# Altium schematic sheet 02-POWER SUPPLY.SchDoc
size A4
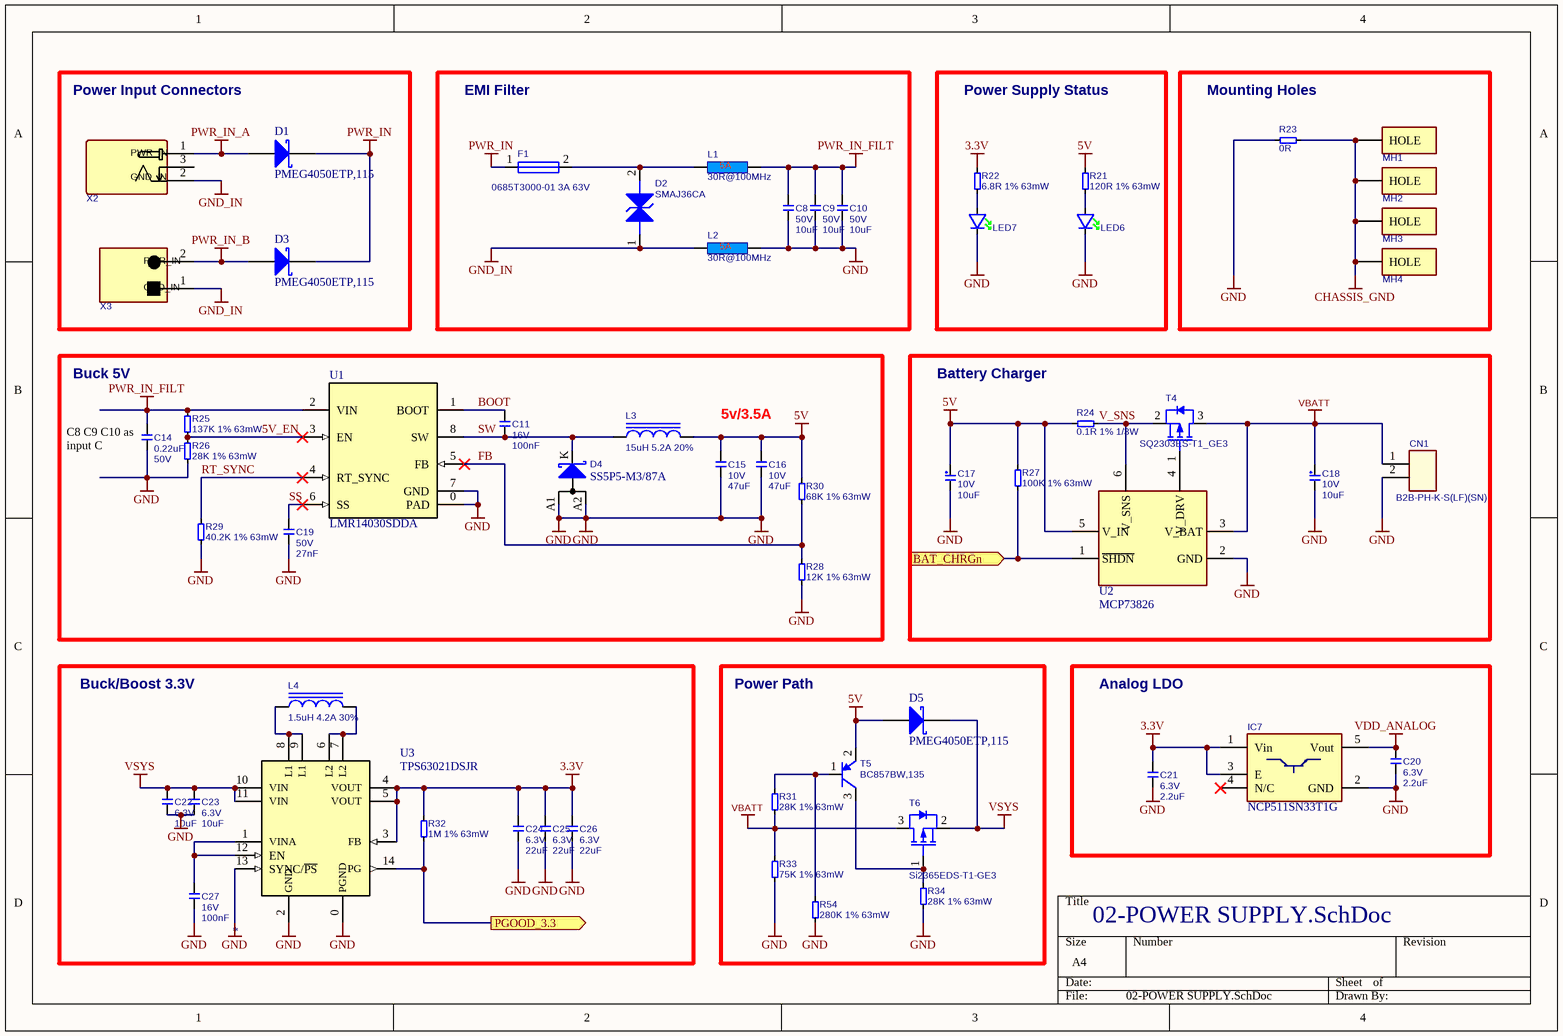
[diagram p0: 02-POWER SUPPLY.SchDoc]

## Parts
C8  value 10uF  Rating: 50V  [CAPC3225X160N]  (hidden comment: 10uF 50V 20% X5R)
C9  value 10uF  Rating: 50V  [CAPC3225X160N]  (hidden comment: 10uF 50V 20% X5R)
C10  value 10uF  Rating: 50V  [CAPC3225X160N]  (hidden comment: 10uF 50V 20% X5R)
C11  value 100nF  Rating: 16V  [CAPC1005X60N]  (hidden comment: 100nF 16V 10% X7R)
C14  value 0.22uF  Rating: 50V  [T_CAPC0805X125N]  (hidden comment: 0.22uF 50V 10% X7R)
C15  value 47uF  Rating: 10V  [CAPC3225X160N]  (hidden comment: 47uF 10V 20% X5R)
C16  value 47uF  Rating: 10V  [CAPC3225X160N]  (hidden comment: 47uF 10V 20% X5R)
C17  value 10uF  Rating: 10V  [T_CAPC1206X180N]  (hidden comment: 10uF 10V 20% Tantalum)
C18  value 10uF  Rating: 10V  [T_CAPC1206X180N]  (hidden comment: 10uF 10V 20% Tantalum)
C19  value 27nF  Rating: 50V  [T_CAPC0603X33N]  (hidden comment: 27nF 50V 20% X7R)
C20  value 2.2uF  Rating: 6.3V  [T_CAPC0603X33N]  (hidden comment: 2.2uF 6.3V 20% X5R)
C21  value 2.2uF  Rating: 6.3V  [T_CAPC0603X33N]  (hidden comment: 2.2uF 6.3V 20% X5R)
C22  value 10uF  Rating: 6.3V  [T_CAPC0603X33N]  (hidden comment: 10uF 6.3V 20% X5R)
C23  value 10uF  Rating: 6.3V  [T_CAPC0603X33N]  (hidden comment: 10uF 6.3V 20% X5R)
C24  value 22uF  Rating: 6.3V  [T_CAPC0603X33N]  (hidden comment: 22uF 6.3V 20% X5R)
C25  value 22uF  Rating: 6.3V  [T_CAPC0603X33N]  (hidden comment: 22uF 6.3V 20% X5R)
C26  value 22uF  Rating: 6.3V  [T_CAPC0603X33N]  (hidden comment: 22uF 6.3V 20% X5R)
C27  value 100nF  Rating: 16V  [CAPC1005X60N]  (hidden comment: 100nF 16V 10% X7R)
CN1  B2B-PH-K-S(LF)(SN)  [B2B-PH-K-S(LF)(SN) - duplicate]
D1  PMEG4050ETP,115  [D_SOD128]
D2  SMAJ36CA  [T_LITTLEFUSE_SMAJ30CA]
D3  PMEG4050ETP,115  [D_SOD128]
D4  SS5P5-M3/87A  [T_DIOM_TO277A]
D5  PMEG4050ETP,115  [D_SOD128]
F1  0685T3000-01 3A 63V  [RESC3216N]
IC7  NCP511SN33T1G  [SOT95P279X142-5N]
L1  value 30R@100MHz  [INDC1608X95N]  (hidden comment: BLM18KG300TN1D)
L2  value 30R@100MHz  [INDC1608X95N]  (hidden comment: BLM18KG300TN1D)
L3  15uH 5.2A 20%  [T_INDM125125X80N]
L4  1.5uH 4.2A 30%  [L_NR6028]
LED6  150060GS75000  [LEDC1608X80N]  (value not drawn)
LED7  150060GS75000  [LEDC1608X80N]  (value not drawn)
MH1  MECH-MountingHoles  [T_MountingHoles]  (value not drawn)  (no BOM)
MH2  MECH-MountingHoles  [T_MountingHoles]  (value not drawn)  (no BOM)
MH3  MECH-MountingHoles  [T_MountingHoles]  (value not drawn)  (no BOM)
MH4  MECH-MountingHoles  [T_MountingHoles]  (value not drawn)  (no BOM)
R21  120R 1% 63mW  [RESC1005X40N]
R22  6.8R 1% 63mW  [RESC1005X40N]
R23  0R  [RESC1005X40N]
R24  0.1R 1% 1/3W  [RESC1608N]
R25  137K 1% 63mW  [RESC1005X40N]
R26  28K 1% 63mW  [RESC1005X40N]
R27  100K 1% 63mW  [RESC1005X40N]
R28  12K 1% 63mW  [RESC1005X40N]
R29  40.2K 1% 63mW  [RESC1005X40N]
R30  68K 1% 63mW  [RESC1005X40N]
R31  28K 1% 63mW  [RESC1005X40N]
R32  1M 1% 63mW  [RESC1005X40N]
R33  75K 1% 63mW  [RESC1005X40N]
R34  28K 1% 63mW  [RESC1005X40N]
R54  280K 1% 63mW  [RESC1005X40N]
T4  SQ2303ES-T1_GE3  [SOT95P230X110-3N]
T5  BC857BW,135  [SOT65P210X110-3N]
T6  Si2365EDS-T1-GE3  [SOT95P230X110-3N]
U1  LMR14030SDDA  [SOIC127P600X175-9AN-2]
U2  MCP73826  [SOT95P284X122-6N]
U3  TPS63021DSJR  [DSJ14_2P85X1P58]
X2  54-00167  [PJ-002A]  (value not drawn)
X3  1984617  [TERM-BLK-3.5MM]  (value not drawn)

## Blocks framed on the sheet
Power Input Connectors: D1 D3 X2 X3
EMI Filter: C8-C10 D2 F1 L1 L2
Power Supply Status: LED6 LED7 R21 R22
Mounting Holes: MH1-MH4 R23
Battery Charger: C17 C18 CN1 R24 R27 T4 U2
Buck/Boost 3.3V: C22-C27 L4 R32 U3
Power Path: D5 R31 R33 R34 R54 T5 T6
Analog LDO: C20 C21 IC7

## Ports
BAT_CHRGn (in), PGOOD_3.3 (out)

## Nets
3.3V: C21.2 C24.2 C25.2 C26.2 IC7.1(Vin) IC7.3(E) R22.2 R32.2 U3.3(FB) U3.4(VOUT) U3.5(VOUT)
5V: C15.2 C16.2 C17.2 D5.2(A) L3.2 R21.2 R24.2 R27.2 R30.2 T5.2(E) U2.5(V_IN)
CHASSIS_GND: MH1.1(HOLE) MH2.1(HOLE) MH3.1(HOLE) MH4.1(HOLE) R23.1
GND: C8.1 C9.1 C10.1 C14.1 C15.1 C16.1 C17.1 C18.1 C19.1 C20.1 C21.1 C22.1 C23.1 C24.1 C25.1 C26.1 C27.1 CN1.2 D4.A1 D4.A2 IC7.2(GND) L2.1 LED6.1 LED7.1 R23.2 R26.1 R28.2 R29.1 R33.1 R34.1 R54.1 U1.0(PAD) U1.7(GND) U2.2(GND) U3.0(PGND) U3.2(GND) U3.13(SYNC/~{PS})
GND_IN: D2.1(ANODE) L2.2 X2.2(PWR_IN) X3.1(GND_IN)
PWR_IN: D1.1(K) D3.1(K) F1.1
PWR_IN_A: D1.2(A) X2.1(GND_IN)
PWR_IN_B: D3.2(A) X3.2(PWR_IN)
PWR_IN_FILT: C8.2 C9.2 C10.2 C14.2 L1.1 R25.2 U1.2(VIN)
VBATT: C18.2 CN1.1 R31.1 R33.2 T4.3(S) T6.3(S) U2.3(V_BAT)
VDD_ANALOG: C20.2 IC7.5(Vout)
VSYS: C22.2 C23.2 D5.1(K) T6.2(D) U3.10(VIN) U3.11(VIN)
5V_EN: R25.1 R26.2 U1.3(EN)
BAT_CHRGn: R27.1 U2.1(~{SHDN}) ; port BAT_CHRGn
BOOT: C11.1 U1.1(BOOT)
FB: R28.1 R30.1 U1.5(FB)
PGOOD_3.3: R32.1 U3.14(PG) ; port PGOOD_3.3
RT_SYNC: R29.2 U1.4(RT_SYNC)
SS: C19.2 U1.6(SS)
SW: C11.2 D4.K L3.1 U1.8(SW)
V_SNS: R24.1 T4.2(D) U2.6(V_SNS)
NetC27_2: C27.2 U3.1(VINA) U3.12(EN)
NetD2_2: D2.2(CATHODE) F1.2 L1.2
NetL4_1: L4.1 U3.8(L1) U3.9(L1)
NetL4_2: L4.2 U3.6(L2) U3.7(L2)
NetLED6_2: LED6.2 R21.1
NetLED7_2: LED7.2 R22.1
NetR31_2: R31.2 R54.2 T5.1(B)
NetR34_2: R34.2 T5.3(C) T6.1(G)
NetT4_1: T4.1(G) U2.4(V_DRV)

Not connected (* = marked no-connect by the designer): IC7 4(N/C)*; X2 3(PWR_IN)

## Notes on the sheet
- Buck 5V
- 5v/3.5A
- (near C14) C8 C9 C10 as input C
- (in symbol L-Murata-30R@100MHz-5A-0603) 5A

## Library data of the parts
C8-C10 = C-10uF-50V-20%-1210: Capacitor Ceramic X5R 10uF 50V 20% 1210; Type: X7R; FP_DESC: C1210; Tolerance: 20%; Supplier 1: Digi-Key; Supplier Part Number 1: 587-2225-1-ND; Footprint: C1210; MFG: *; MFG_PN: *
C11 C27 = C-100nF-16V-10%-0603: Capacitor Ceramic X7R 100nF 16V 10% 0603; FP_DESC: C0402; Tolerance: 10%; Type: X7R; Supplier 1: Digi-Key; Supplier Part Number 1: 1276-1001-1-ND; Footprint Checked: -; MFG: *; MFG_PN: *
C14 = C-0.22uF-50V-10%-0805: Capacitor Ceramic X7R 0.22uF 50V 10% 0805; FP_DESC: C0805; Tolerance: 10%; Type: X7R; Supplier 1: Digi-Key; Supplier Part Number 1: 1276-1093-1-ND; MFG_PN: *; MFG: *
C15 C16 = C-47uF-10V-20%-1210: Capacitor Ceramic X5R 47uF 10V 20% 1210; FP_DESC: C1210; Tolerance: 20%; Type: X5R; Supplier 1: Digi-Key; Supplier Part Number 1: 445-6711-1-ND; MFG: *; MFG_PN: *
C17 C18 = C-10uF-10V-20%-1206: Capacitor Tantalum 10uF 10V 20% 1206; FP_DESC: C1206; Tolerance: 20%; Type: Tantalum; Supplier 1: Digi-Key; Supplier Part Number 1: 478-1657-1-ND; MFG: *; MFG_PN: *
C19 = C-27nF-50V-10%-0603: Capacitor Ceramic X7R 27nF 50V 10% 0603; FP_DESC: C0603; Tolerance: 10%; Type: X7R; Supplier 1: Digi-Key; Supplier Part Number 1: 1276-2025-1-ND; MFG: *; MFG_PN: *
C20 C21 = C-2.2uF-6.3V-20%-0603: Capacitor Ceramic X5R 2.2uF 6.3V 20% 0603; FP_DESC: C0603; Tolerance: 20%; Supplier 1: Digi-Key; Supplier Part Number 1: 311-1814-1-ND; Type: X5R; MFG: *; MFG_PN: *
C22 C23 = C-10uF-6.3V-20%-0603: Capacitor Ceramic X5R 10uF 6.3V 20% 0603; Type: X7R; FP_DESC: C0603; Tolerance: 20%; Supplier 1: Digi-Key; Supplier Part Number 1: 490-3896-1-ND; MFG: *; MFG_PN: *
C24-C26 = C-22uF-6.3V-20%-0603: Capacitor Ceramic X5R 22uF 6.3V 20% 0603; FP_DESC: C0603; Tolerance: 20%; Type: X5R; Supplier 1: Digi-Key; Supplier Part Number 1: 445-8028-1-ND; MFG: *; MFG_PN: *
CN1 = CON-JST-B2B-PH-K-S(LF)(SN): Connector Header Through Hole 2 position 0.079" (2.00mm); MFG: JST; FP_DESC: Header, Male pins, 1x2, 2mm, Vertical; Symbol Checked: Ok; MFG_PN: B2B-PH-K-S(LF)(SN); Footprint Checked: Assign OK, Footprint OK; Supplier 1: Digi-Key; Supplier Part Number 1: 455-1704-ND
D1 D3 D5 = D-NXP- PMEG4050ETP,115: Diode Schottky 40V 5A Surface Mount CFP5; MFG: Nexperia USA Inc.; Supplier 1: Digi-Key; Supplier Part Number 1: 1727-1732-1-ND; MFG_PN: PMEG4050ETP,115; Footprint Checked: -; Symbol Checked: -
D2 = D-Vishay-SMAJ36CA: 58.1V Clamp 6.9A Ipp Tvs Diode Surface Mount DO-214AC (SMA); MFG: Vishay; Symbol Checked: Ok; FP_DESC: SMA; MFG_PN: SMAJ36CA; Footprint Checked: Assign OK, Footprint OK; Supplier 1: Digi-Key; Supplier Part Number 1: SMAJ36CALFCT-ND
D4 = D-Vishay-SS5P5-M3/87A: Diode Schottky, SS5P5-M3/87A, 50V(Vrrm), 5A(If); MFG: Vishay; MFG_PN: SS8P6C-M3/86A; Supplier 1: Digi-Key; Supplier Part Number 1: SS5P5-M3/87AGICT-ND; Footprint Checked: -; Symbol Checked: -
F1 = F-BEL-3A-63V: 3A 63V AC 63V DC Fuse Board Mount (Cartridge Style Excluded) Surface Mount 1206 (3216 Metric); FP_DESC: R1206; MFG: BEL; POWER: 250mW; MFG_PN: 0685T3000-01; Footprint Checked: -; VALUE: 3A; Symbol Checked: -; Supplier 1: Digi-Key; Supplier Part Number 1: 507-1896-1-ND
IC7 = IC-ON-NCP511SN33T1G: NCP511SN33T1G LDO Regulator; MFG: ON Semiconductor; Supplier 1: Digi-Key; Supplier Part Number 1: NCP511SN33T1GOSCT-ND; Footprint Checked: -; Symbol Checked: -; MFG_PN: NCP511SN33T1G
L1 L2 = L-Murata-30R@100MHz-5A-0603: 30 Ohms @ 100MHz 1 Power Line Ferrite Bead 0603 (1608 Metric) 5A 10mOhm; Rating: 4A; Tolerance: 25%; MFG: EXC-ML20A390U; Supplier 1: Digi-Key; Supplier Part Number 1: 490-5447-1-ND; Footprint Checked: Ok, Assign Ok; Symbol Checked: -
L3 = L-Bourns-SRR1280-150M: FIXED IND 15UH 5.2A 28.5MOHM SMD; MFG: Bourns Inc.; FP_DESC: Non Standard; Footprint Checked: -; Symbol Checked: -; Value: 15uH; Supplier 1: Digi-Key; Supplier Part Number 1: SRR1280-150MCT-ND; MFG_PN: SRR1280-150M
L4 = L-1.5uH-4.2A-30%: Inductor Ferrite core 1.5uH 4.2A 30%; MFG: TAIYO YUDEN; FP_DESC: L1008; MFG_PN: NRS6028T1R5NMGJ; Footprint Checked: -; Symbol Checked: -; Value: 1.5uH; Supplier 1: Digi-Key; Supplier Part Number 1: 587-2937-1-ND
LED6 LED7 = LED-GREEN-0603: Green 520nm LED Indication - Discrete 3.2V 0603 (1608 Metric); MFG: Würth Elektronik; MFG_PN: 150060GS75000; Color: Green; Supplier 1: Digi-Key; Supplier Part Number 1: 732-4971-1-ND; Footprint Checked: -; Symbol Checked: -
MH1-MH4 = MECH-MountingHoles: PCB Mounting Holes, hole diemeter = 3.2mm, pad diameter = 6.2mm; Footprint Checked: -; Symbol Checked: -
R21 = R-120R-1%-0402: Resistor 120ohm 63mW 1% 0402; MFG: <GENERIC>; Power: 63mW; Tolerance: 1%; Footprint: R0402; Value: 120R; Supplier 1: Digi-Key; Supplier Part Number 1: 541-120LCT-ND; Footprint Checked: -; Symbol Checked: -; MFG_PN: <GENERIC>
R22 = R-6.8R-1%-0402: Resistor 6.8ohm 63mW 1% 0402; Manufacturer: <GENERIC>; Replacement Allowed: Yes; Power: 63mW; Tolerance: 1%; Footprint: R0402; Value: 6.8R; Supplier 1: Digi-Key; Supplier Part Number 1: 541-68.0LCT-ND; Manufacturer Part Number: <GENERIC>
R23 = R-0R-0402: Resistor 0ohm 0402; Tolerance: 1%; MFG: <GENERIC>; Power: ?; Value: 0R; Footprint: R0402; Supplier 1: Digi-Key; Supplier Part Number 1: 541-2952-1-ND; Footprint Checked: -; MFG_PN: <GENERIC>; Symbol Checked: -
R24 = R-0.1-1%-0603: Resistor 0.1ohm 1/3W 1% 0603; Power: 1/3; MFG: <GENERIC>; Tolerance: 1%; Value: 0.1R; Footprint: R0603; Supplier 1: Digi-Key; Supplier Part Number 1: P17478CT-ND; Footprint Checked: -; Symbol Checked: -; MFG_PN: <GENERIC>
R25 = R-137K-1%-0402: Resistor 137Kohm 63mW 1% 0402; Symbol Checked: T; MFG: <GENERIC>; Power: 63mW; Tolerance: 1%; Footprint: R0402; Value: 137k; Supplier 1: Digi-Key; Supplier Part Number 1: 541-137KLCT-ND; Footprint Checked: -; MFG_PN: <GENERIC>
R26 R31 R34 = R-28K-1%-0402: Resistor 28Kohm 63mW 1% 0402; Symbol Checked: T; MFG: <GENERIC>; Power: 63mW; Tolerance: 1%; Footprint: R0402; Value: 28k; Supplier 1: Digi-Key; Supplier Part Number 1: 541-4852-1-ND; Footprint Checked: -; MFG_PN: <GENERIC>
R27 = R-100K-1%-0402: Resistor 100Kohm 63mW 1% 0402; Manufacturer: <GENERIC>; Replacement Allowed: Yes; Power: 63mW; Tolerance: 1%; Value: 100k; Footprint: R0402; Supplier 1: Digi-Key; Supplier Part Number 1: 541-100KLCT-ND; Manufacturer Part Number: <GENERIC>
R28 = R-12K-1%-0402: Resistor 12Kohm 63mW 1% 0402; Symbol Checked: T; MFG: <GENERIC>; Power: 63mW; Tolerance: 1%; Footprint: R0402; Value: 12K; Supplier 1: Digi-Key; Supplier Part Number 1: 541-4063-1-ND; Footprint Checked: -; MFG_PN: <GENERIC>
R29 = R-40.2K-1%-0402: Resistor 40.2Kohm 63mW 1% 0402; Symbol Checked: T; MFG: <GENERIC>; Power: 63mW; Tolerance: 1%; Footprint: R0402; Value: 40.2k; Supplier 1: Digi-Key; Supplier Part Number 1: 541-40.2KLCT-ND; Footprint Checked: -; MFG_PN: <GENERIC>
R30 = R-68K-1%-0402_1: Resistor 68Kohm 63mW 1% 0402; Symbol Checked: T; MFG: <GENERIC>; Power: 63mW; Tolerance: 1%; Footprint: R0402; Value: 68K; Supplier 1: Digi-Key; Supplier Part Number 1: 541-68.0KLCT-ND; Footprint Checked: -; MFG_PN: <GENERIC>
R32 = R-1M-1%-0402: Resistor 1Mohm 63mW 1% 0402; Manufacturer: <GENERIC>; Replacement Allowed: Yes; Power: 63mW; Tolerance: 1%; Footprint: R0402; Value: 1M; Supplier 1: Digi-Key; Supplier Part Number 1: 541-1.00MLCT-ND; Manufacturer Part Number: <GENERIC>
R33 = R-75K-1%-0402: Resistor 75Kohm 63mW 1% 0402; MFG: <GENERIC>; Power: 63mW; Tolerance: 1%; Footprint: R0402; Value: 75k; Supplier 1: Digi-Key; Supplier Part Number 1: 541-75.0KLCT-ND; Footprint Checked: -; Symbol Checked: -; MFG_PN: <GENERIC>
R54 = R-280K-1%-0402: Resistor 280Kohm 63mW 1% 0402; MFG: <GENERIC>; Power: 63mW; Tolerance: 1%; Footprint: R0402; Value: 280k; Supplier 1: Digi-Key; Supplier Part Number 1: 541-280KLCT-ND; Footprint Checked: -; Symbol Checked: -; MFG_PN: <GENERIC>
T4 = T-Vishay-SQ2303ES: P-Channel 30V 2.5A (Tc) 1.9W (Tc) Surface Mount TO-236 (SOT-23); MFG: VISHAY; FP_DESC: SOT23-3; MFG_PN: SQ2303ES-T1_GE3; Footprint Checked: -; Symbol Checked: -; Supplier 1: Digi-Key; Supplier Part Number 1: SQ2303ES-T1_GE3CT-ND
T5 = T-NXP-BC857BW: PNP Transistor NXP BC857BW,135; FP_DESC: SOT323; MFG: NXP; MFG_PN: BC857BW,135; Footprint Checked: -; Symbol Checked: -; Supplier 1: Digi-Key; Supplier Part Number 1: 1727-1882-1-ND
T6 = T-Vishay-Si2365EDS: MOSFET, P channel Vishay Si2365EDS-T1-GE3; FP_DESC: SOT23-3; MFG: VISHAY; MFG_PN: Si2365EDS-T1-GE3; Footprint Checked: -; Symbol Checked: -; Supplier 1: Digi-Key; Supplier Part Number 1: SI2365EDS-T1-GE3CT-ND
U1 = IC-TI-LMR14030: Buck Switching Regulator IC Positive Adjustable 0.8V 1 Output 3.5A 8-PowerSOIC (0.154", 3.90mm Width); Symbol Checked: DMT; MFG: Texas Instruments; Type: DEV; Value: Value; Supplier 1: Digi-Key; Supplier Part Number 1: 296-44321-1-ND; Footprint Checked: -
U2 = IC-Microchip-MCP73826: Charger IC Lithium Ion SOT-23-6; Symbol Checked: D; MFG_PN: MCP73826-4.1VCHTR; Footprint Checked: -; MFG: Microchip; Supplier 1: Digi-Key; Supplier Part Number 1: MCP73826-4.1VCHCT-ND
U3 = IC-TI-TPS63021: Buck-Boost Switching Regulator IC Positive Fixed 3.3V 1 Output 3.5A (Switch) 14-VFDFN Exposed Pad; MFG: Texas Instruments; Type: DEV; Value: Value; Supplier 1: Digi-Key; Supplier Part Number 1: 296-27259-1-ND; Footprint Checked: D; Symbol Checked: -; Parameter 1: *
X2 = CON-Tensility-54-00167: Power Barrel Connector Jack 2.50mm ID (0.098"), 5.50mm OD (0.217") Through Hole, Right Angle; MFG: Tensility International Corp; Supplier 1: Digi-Key; Supplier Part Number 1: 839-54-00167-ND; Footprint Checked: -; MFG_PN: 54-00167; Symbol Checked: -
X3 = CON-Phoenix-1984617-1x2-3.5mm: 2 Position Wire to Board Terminal Block Horizontal with Board 0.138" (3.50mm) Through Hole; No. of ways: 1x2; Pitch: 3.5mm; MFG: Phoenix Contact; Supplier 1: Digi-Key; Supplier Part Number 1: 277-1721-ND; Footprint Checked: -; MFG_PN: 1984617; Symbol Checked: -